# EAGLE design NYSERDA_LCS_PROJECT_V1 (EAGLE 9.0.1)
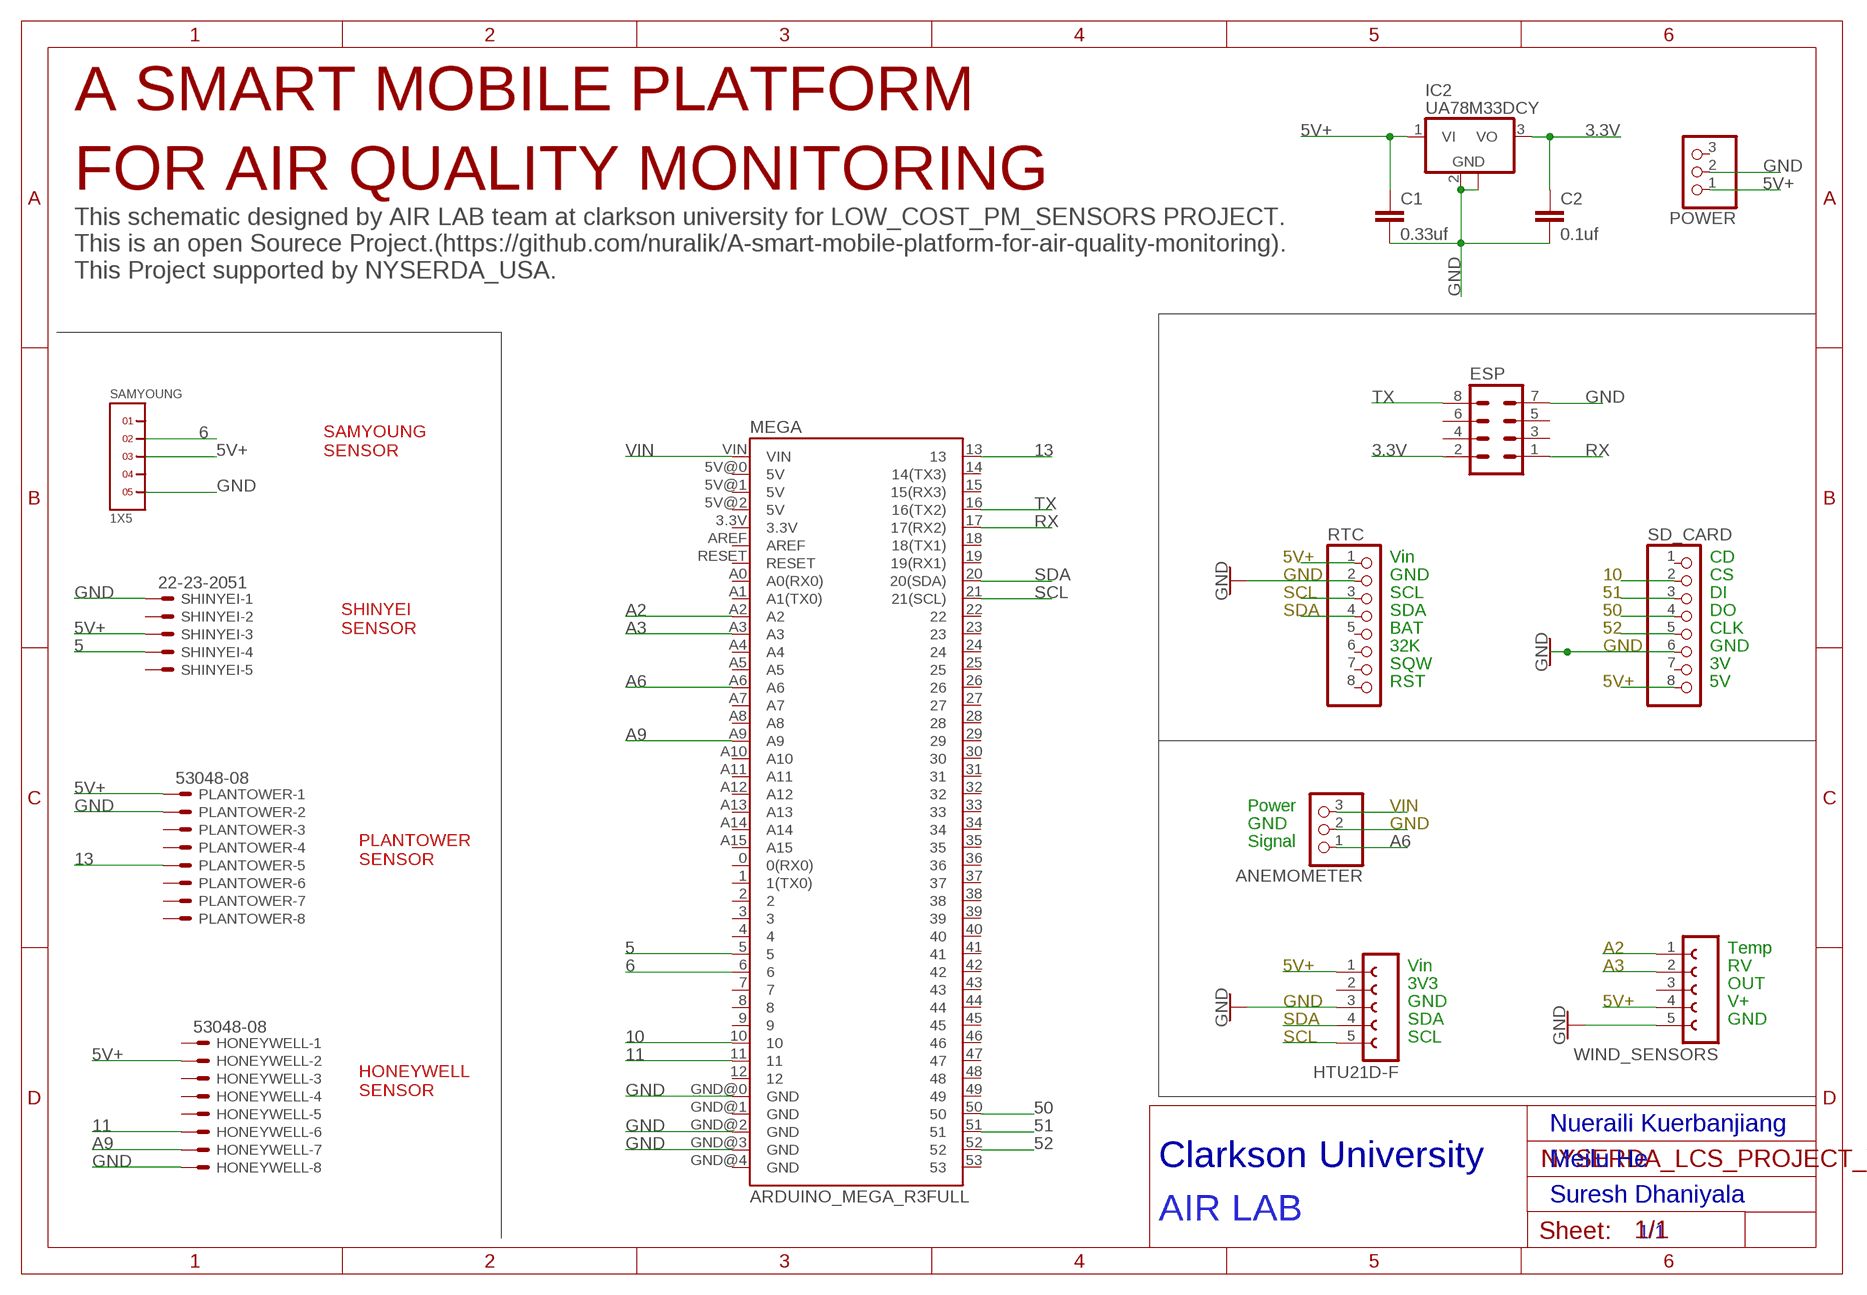
[diagram p0: schematic, sheet 1]

## Parts
ANEMOMETER  PINHD-1X3  [1X03]
C1  0.33uf  C2.5/2  [C2.5-2]
C2  0.1uf  C2.5/2  [C2.5-2]
ESP  MA04-2  [MA04-2]
HONEYWELL  53048-08  [53048-08]
HTU21D-F  FE05-1  [FE05-1]
IC2  UA78M33DCY  [SOT223]
MEGA  ARDUINO_MEGA_R3FULL  [ARDUINO_MEGA]
PLANTOWER  53048-08  [53048-08]
POWER  PINHD-1X3  [1X03]
RTC  PINHD-1X8BIG  [1X08-BIG]
SAMYOUNG  1X5  [1X5]
SD_CARD  PINHD-1X8BIG  [1X08-BIG]
SHINYEI  22-23-2051  [22-23-2051]
WIND_SENSORS  FE05-1  [FE05-1]

## Nets
3.3V: C2.1 ESP.2 IC2.3(VO)
5: MEGA.5 SHINYEI.4
5V+: C1.1 HONEYWELL.2 HTU21D-F.1 IC2.1(VI) PLANTOWER.1 POWER.1 RTC.1 SAMYOUNG.3 SD_CARD.8 SHINYEI.3 WIND_SENSORS.4
6: MEGA.6 SAMYOUNG.2
10: MEGA.10 SD_CARD.2
11: HONEYWELL.6 MEGA.11
13: MEGA.13 PLANTOWER.5
50: MEGA.50 SD_CARD.4
51: MEGA.51 SD_CARD.3
52: MEGA.52 SD_CARD.5
A2: MEGA.A2 WIND_SENSORS.1
A3: MEGA.A3 WIND_SENSORS.2
A6: ANEMOMETER.1 MEGA.A6
A9: HONEYWELL.7 MEGA.A9
GND: ANEMOMETER.2 C1.2 C2.2 ESP.7 HONEYWELL.8 HTU21D-F.3 IC2.2(GND) IC2.4(GND) MEGA.GND@0(GND) MEGA.GND@2(GND) MEGA.GND@3(GND) PLANTOWER.2 POWER.2 RTC.2 SAMYOUNG.5 SD_CARD.6 SHINYEI.1 WIND_SENSORS.5
RX: ESP.1 MEGA.17(17(RX2))
SCL: HTU21D-F.5 MEGA.21(21(SCL)) RTC.3
SDA: HTU21D-F.4 MEGA.20(20(SDA)) RTC.4
TX: ESP.8 MEGA.16(16(TX2))
VIN: ANEMOMETER.3 MEGA.VIN
Unconnected: ESP.3 ESP.4 ESP.5 ESP.6 HONEYWELL.1 HONEYWELL.3 HONEYWELL.4 HONEYWELL.5 HTU21D-F.2 MEGA.0(0(RX0)) MEGA.1(1(TX0)) MEGA.2 MEGA.3 MEGA.3.3V MEGA.4 MEGA.5V@0(5V) MEGA.5V@1(5V) MEGA.5V@2(5V) MEGA.7 MEGA.8 MEGA.9 MEGA.12 MEGA.14(14(TX3)) MEGA.15(15(RX3)) MEGA.18(18(TX1)) MEGA.19(19(RX1)) MEGA.22 MEGA.23 MEGA.24 MEGA.25 MEGA.26 MEGA.27 MEGA.28 MEGA.29 MEGA.30 MEGA.31 MEGA.32 MEGA.33 MEGA.34 MEGA.35 MEGA.36 MEGA.37 MEGA.38 MEGA.39 MEGA.40 MEGA.41 MEGA.42 MEGA.43 MEGA.44 MEGA.45 MEGA.46 MEGA.47 MEGA.48 MEGA.49 MEGA.53 MEGA.A0(A0(RX0)) MEGA.A1(A1(TX0)) MEGA.A4 MEGA.A5 MEGA.A7 MEGA.A8 MEGA.A10 MEGA.A11 MEGA.A12 MEGA.A13 MEGA.A14 MEGA.A15 MEGA.AREF MEGA.GND@1(GND) MEGA.GND@4(GND) MEGA.RESET PLANTOWER.3 PLANTOWER.4 PLANTOWER.6 PLANTOWER.7 PLANTOWER.8 POWER.3 RTC.5 RTC.6 RTC.7 RTC.8 SAMYOUNG.1 SAMYOUNG.4 SD_CARD.1 SD_CARD.7 SHINYEI.2 SHINYEI.5 WIND_SENSORS.3

## Notes on the sheet
- A SMART MOBILE PLATFORM 
  FOR AIR QUALITY MONITORING
- This schematic designed by AIR LAB team at clarkson university for LOW_COST_PM_SENSORS PROJECT.
  This is an open Sourece Project.(https://github.com/nuralik/A-smart-mobile-platform-for-air-quality-monitoring).
  This Project supported by NYSERDA_USA.
- SAMYOUNG
  SENSOR
- Vin | CD
- GND | CS
- SCL | DI
- SDA | DO
- SHINYEI 
  SENSOR
- BAT | CLK
- 32K | GND
- SQW | 3V
- RST | 5V
- Power
- GND
- Signal
- PLANTOWER
  SENSOR
- Temp
- Vin | RV
- 3V3 | OUT
- GND | V+
- SDA | GND
- SCL
- HONEYWELL
  SENSOR
- Nueraili Kuerbanjiang
- Clarkson | University | Meilu He
- Suresh Dhaniyala
- AIR LAB
- 1/1

## Library data of the parts
ANEMOMETER POWER = adafruit:PINHD-1X3: PIN HEADER
C1 C2 = capacitor-wima:C: CAPACITOR naming: grid - package width
ESP = con-lstb:MA04-2: PIN HEADER; OC_FARNELL: unknown; OC_NEWARK: unknown
HONEYWELL PLANTOWER = con-molex:53?-08: CONNECTOR wire to board 1.25 mm (.049 inch) pitch header; MF: WALDOM/MOLEX; MPN: 53048-0810; OC_FARNELL: 9733094; OC_NEWARK: 38C9913
HTU21D-F WIND_SENSORS = con-lsta:FE05-1: FEMALE HEADER; OC_FARNELL: unknown; OC_NEWARK: unknown
IC2 = linear:UA78M*: POSITIVE-VOLTAGE REGULATORS Source: http://focus.ti.com/lit/ds/symlink/ua78m33.pdf
MEGA = SparkFun-Boards:ARDUINO_MEGA_R3: Arduino Mega R3 ATmega2560 R3 compatible footprint. SparkFun Products: Arduino Mega 2560 R3 <https://www.sparkfun.com/products/11061>
RTC SD_CARD = adafruit:PINHD-1X8: PIN HEADER
SAMYOUNG = headers(2mm)(samtec):1X5
SHINYEI = con-molex:22-23-2051: .100" (2.54mm) Center Header - 5 Pin; MF: MOLEX; MPN: 22-23-2051; OC_FARNELL: 1462952; OC_NEWARK: 38C9178

## Board
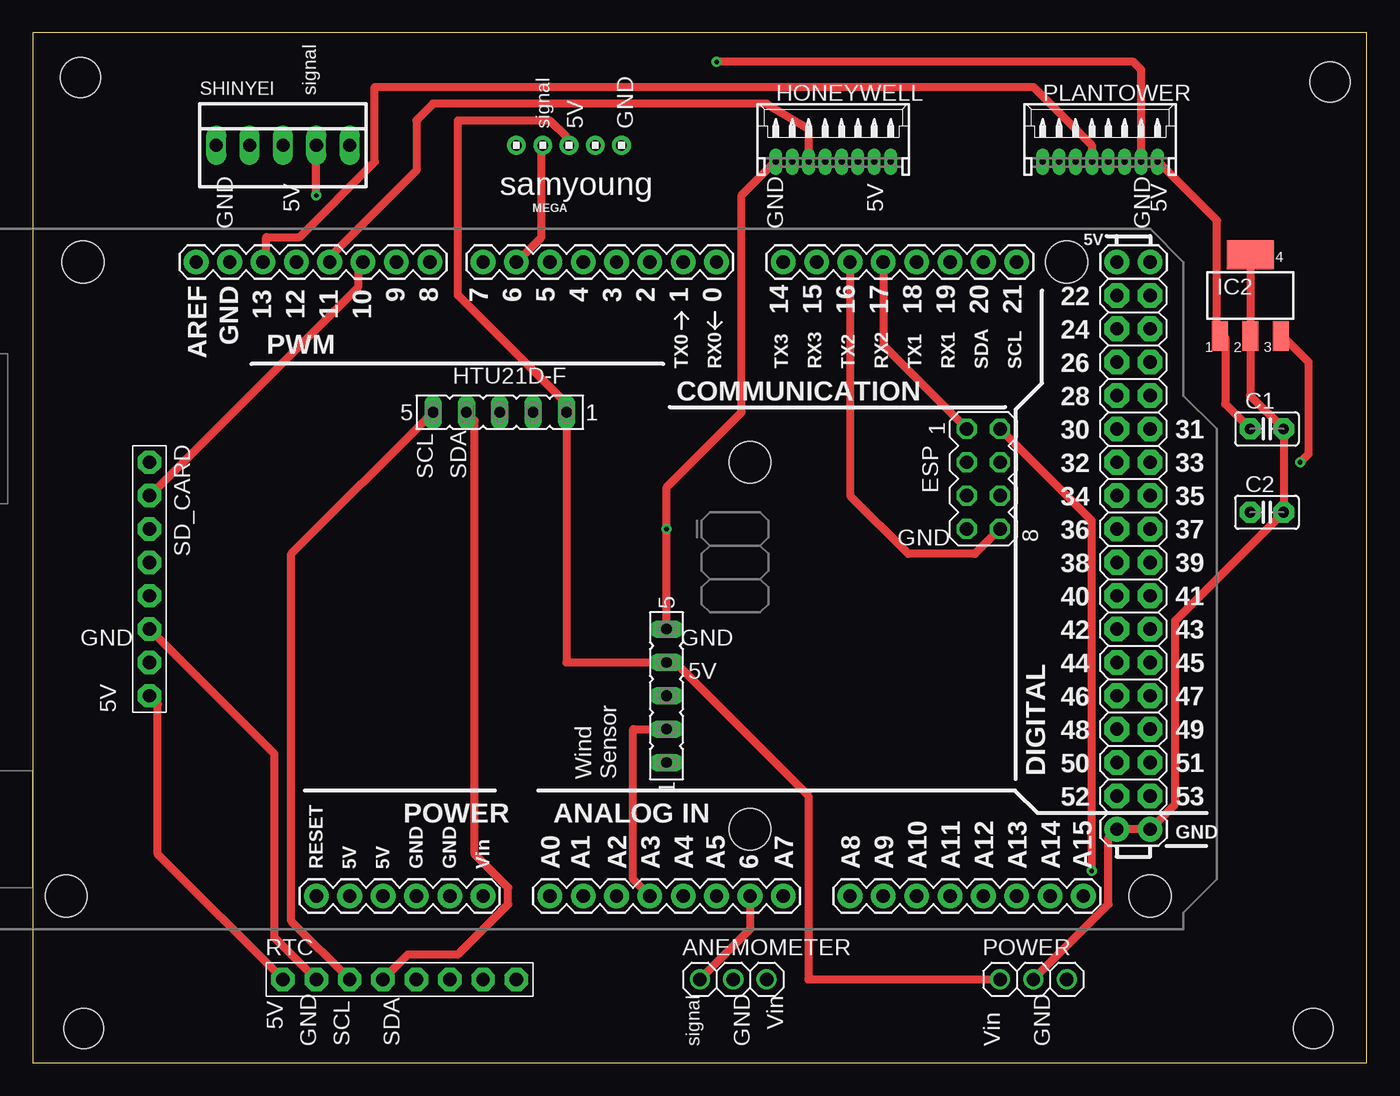
[diagram p1: board, top side]
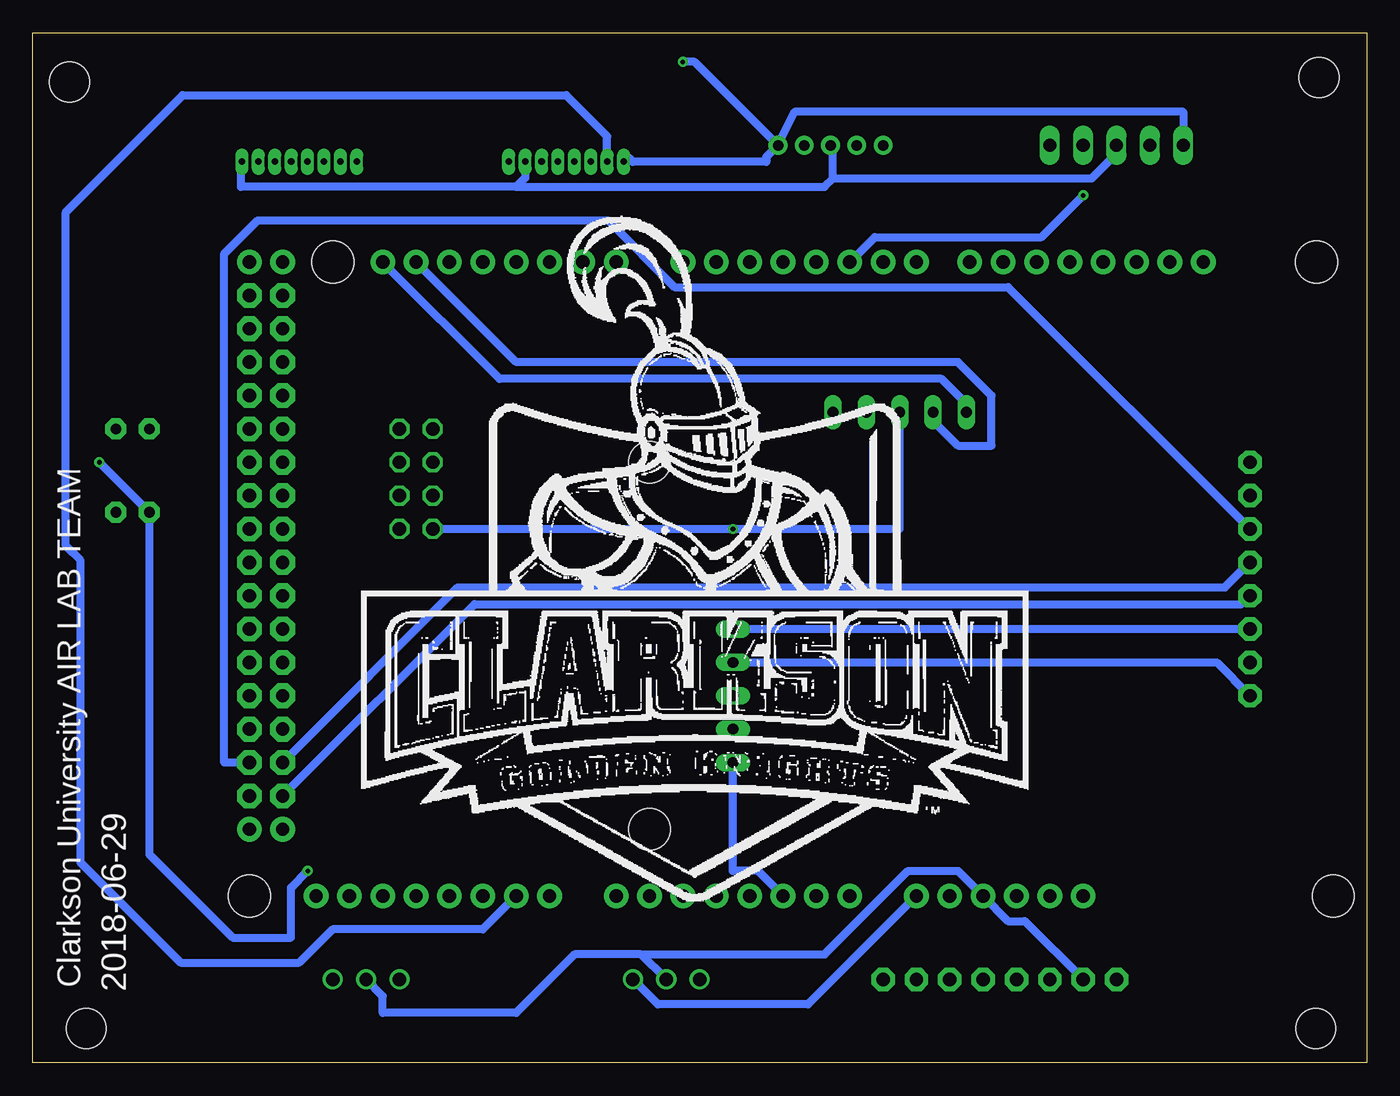
[diagram p2: board, bottom side, seen from below]

Size 101.58 x 78.41 mm. Coordinates in mm from the lower left corner, seen from the top.
Outline: 0,0 101.58,0 101.58,78.41 0,78.41 0,0
Copper layers (1*16): Top 0.035mm / dielectric 1.5mm / Bottom 0.035mm
Design rules "default *": minimum track width 24mil, minimum drill 0.35mm, track to track 16mil, track to pad 16mil, pad to pad 6mil, via to via 16mil, smd to smd 6mil, copper to edge 40mil, drill to drill 6mil, minimum pad ring 10mil, minimum via ring 8mil, stop-mask expansion 4mil, vias tented up to drill 0mil, thermal gap 10mil
Holes 3.05 mm at 3.63,75 3.88,2.62 97.51,2.62 98.78,74.67

### Footprints (pad centres in the part's own frame; a part is rotated, then mirrored left to right if it is on the bottom)
1X03 = drill 1.016: 1 -2.54,0; 2 0,0; 3 2.54,0
C2.5-2 = drill 0.813 pad 1.6 octagon: 1 -1.27,0; 2 1.27,0
MA04-2 = drill 1.016 octagon: 1 -3.81,-1.27; 2 -3.81,1.27; 3 -1.27,-1.27; 4 -1.27,1.27; 5 1.27,-1.27; 6 1.27,1.27; 7 3.81,-1.27; 8 3.81,1.27
53048-08 = drill 0.5 pad 0.698 long: 1 4.375,-1.25; 2 3.125,-1.25; 3 1.875,-1.25; 4 0.625,-1.25; 5 -0.625,-1.25; 6 -1.875,-1.25; 7 -3.125,-1.25; 8 -4.375,-1.25
FE05-1 = drill 0.813 long: 1 -5.08,0; 2 -2.54,0; 3 0,0; 4 2.54,0; 5 5.08,0
SOT223 = smd 1.219 x 2.235: 1 -2.311,-3.099; 2 0,-3.099; 3 2.311,-3.099 | smd 3.6 x 2.2: 4 0,3.099
ARDUINO_MEGA = drill 1.016 pad 1.88: 0 13.97,24.13; 1 11.43,24.13; 2 8.89,24.13; 3 6.35,24.13; 3.3V -13.97,-24.13; 4 3.81,24.13; 5 1.27,24.13; 5V@0 -11.43,-24.13; 5V@1 44.45,24.13; 5V@2 46.99,24.13; 6 -1.27,24.13; 7 -3.81,24.13; 8 -7.874,24.13; 9 -10.414,24.13; 10 -12.954,24.13; 11 -15.494,24.13; 12 -18.034,24.13; 13 -20.574,24.13; 14 19.05,24.13; 15 21.59,24.13; 16 24.13,24.13; 17 26.67,24.13; 18 29.21,24.13; 19 31.75,24.13; 20 34.29,24.13; 21 36.83,24.13; A0 1.27,-24.13; A1 3.81,-24.13; A2 6.35,-24.13; A3 8.89,-24.13; A4 11.43,-24.13; A5 13.97,-24.13; A6 16.51,-24.13; A7 19.05,-24.13; A8 24.13,-24.13; A9 26.67,-24.13; A10 29.21,-24.13; A11 31.75,-24.13; A12 34.29,-24.13; A13 36.83,-24.13; A14 39.37,-24.13; A15 41.91,-24.13; AREF -25.654,24.13; GND@0 -8.89,-24.13; GND@1 -6.35,-24.13; GND@2 44.45,-19.05; GND@3 46.99,-19.05; GND@4 -23.114,24.13; RESET -16.51,-24.13; VIN -3.81,-24.13 | drill 1.016 pad 1.88 octagon: 22 44.45,21.59; 23 46.99,21.59; 24 44.45,19.05; 25 46.99,19.05; 26 44.45,16.51; 27 46.99,16.51; 28 44.45,13.97; 29 46.99,13.97; 30 44.45,11.43; 31 46.99,11.43; 32 44.45,8.89; 33 46.99,8.89; 34 44.45,6.35; 35 46.99,6.35; 36 44.45,3.81; 37 46.99,3.81; 38 44.45,1.27; 39 46.99,1.27; 40 44.45,-1.27; 41 46.99,-1.27; 42 44.45,-3.81; 43 46.99,-3.81; 44 44.45,-6.35; 45 46.99,-6.35; 46 44.45,-8.89; 47 46.99,-8.89; 48 44.45,-11.43; 49 46.99,-11.43; 50 44.45,-13.97; 51 46.99,-13.97; 52 44.45,-16.51; 53 46.99,-16.51 | hole 3.2: -34.29,24.13; -35.56,-24.13; 16.51,8.89; 16.51,-19.05; 40.64,24.13; 46.99,-24.13
1X08-BIG = drill 1.016 pad 1.778 octagon: 1 -8.89,0; 2 -6.35,0; 3 -3.81,0; 4 -1.27,0; 5 1.27,0; 6 3.81,0; 7 6.35,0; 8 8.89,0
1X5 = drill 0.8 pad 1.422: 1 0,0; 2 2,0; 3 4,0; 4 6,0; 5 8,0
22-23-2051 = drill 1 long: 1 -5.08,0; 2 -2.54,0; 3 0,0; 4 2.54,0; 5 5.08,0

### Placement (x,y rotation side)
ANEMOMETER  53.34,6.35 0 top
C1  93.98,48.26 0 top
C2  93.98,41.91 0 top
ESP  72.39,44.45 270 top
HONEYWELL  60.96,69.85 0 top
HTU21D-F  35.56,49.53 180 top
IC2  92.71,58.42 0 top
MEGA  38.1,36.83 0 top
PLANTOWER  81.28,69.85 0 top
POWER  76.2,6.35 0 top
RTC  27.94,6.35 0 top
SAMYOUNG  36.83,69.85 0 top
SD_CARD  8.89,36.83 270 top
SHINYEI  19.05,69.85 0 top
WIND_SENSORS  48.26,27.94 90 top

### Tracks (layer width: path | path; a pad name or v marks a point on that pad's centre or on a via)
3.3V  (via drill 0.35)
  Top 0.61: v96.52,45.72 97.16,46.35 97.16,53.34 95.25,55.24 IC2.3 | ESP.2 80.65,41.27 v80.65,14.61
  Bottom 0.61: v96.52,45.72 C2.1 92.71,15.87 86.36,9.53 81.91,9.53 81.91,13.33 v80.65,14.61
5  (via drill 0.35)
  Top 0.61: v21.59,66.04 SHINYEI.4
  Bottom 0.61: v21.59,66.04 24.76,62.86 37.47,62.86 MEGA.5
5V+
  Top 0.61: SD_CARD.8 9.53,27.3 9.53,15.87 RTC.1 | PLANTOWER.1 85.72,68.58 90.17,64.13 90.17,55.88 IC2.1 90.81,55.24 90.81,50.16 C1.1 | POWER.1 59.06,6.35 59.06,20.32 48.9,30.48 WIND_SENSORS.4 40.64,30.48 HTU21D-F.1 40.64,50.16 32.38,58.42 32.38,71.75 39.37,71.75 40.64,70.48 40.64,69.85 SAMYOUNG.3
  Bottom 0.61: 40.64,67.31 40.64,69.85 SAMYOUNG.3 | 40.64,67.31 20.96,67.31 19.05,69.21 SHINYEI.3 | 64.77,66.67 41.28,66.67 40.64,67.31 | 64.77,66.67 85.72,66.67 85.72,68.58 PLANTOWER.1 | SD_CARD.8 11.43,30.48 WIND_SENSORS.4 | HONEYWELL.2 64.09,67.36 64.77,66.67
6
  Top 0.61: MEGA.6 38.73,62.86 38.73,69.85 SAMYOUNG.2
10
  Top 0.61: SD_CARD.2 24.76,59.05 24.76,60.96 MEGA.10
11
  Top 0.61: HONEYWELL.6 59.06,69.21 59.06,71.12 55.88,73.02 30.48,73.02 29.21,71.75 29.21,67.94 22.86,61.59 22.86,60.96 MEGA.11
13
  Top 0.61: PLANTOWER.5 80.65,69.21 80.65,69.85 76.2,74.3 26.03,74.3 26.03,68.58 20.32,62.86 17.78,62.86 17.78,60.96 MEGA.13
50
  Bottom 0.61: SD_CARD.4 10.79,36.19 69.22,36.19 MEGA.50
51
  Bottom 0.61: SD_CARD.3 27.31,59.05 52.71,59.05 57.78,64.13 84.46,64.13 87,61.59 87,22.86 MEGA.51
52
  Bottom 0.61: SD_CARD.5 9.53,34.92 67.94,34.92 MEGA.52
A2
  Bottom 0.61: WIND_SENSORS.1 48.26,14.61 46.35,14.61 MEGA.A2
A3
  Top 0.61: WIND_SENSORS.2 45.72,25.4 45.72,13.97 MEGA.A3
A6
  Top 0.61: ANEMOMETER.1 54.61,10.16 MEGA.A6
A9
  Bottom 0.61: MEGA.A9 67.31,10.16 78.74,10.16 81.28,7.62 90.33,7.62 97.95,15.24 97.95,38.26 99.06,39.37 99.06,64.77 90.17,73.66 60.96,73.66 57.84,70.53 HONEYWELL.7
GND  (via drill 0.35)
  Top 0.61: IC2.4 IC2.2 92.71,50.8 C1.2 C2.2 87,33.66 87,19.68 MEGA.GND@3 MEGA.GND@2 81.91,17.14 81.91,12.07 POWER.2 | SD_CARD.6 18.41,23.5 18.41,9.53 RTC.2 | WIND_SENSORS.5 v48.26,40.64 48.26,43.81 53.97,49.53 53.97,66.04 56.51,68.58 HONEYWELL.8 | PLANTOWER.2 84.41,75.61 83.82,76.2 v52.07,76.2
  Bottom 0.61: HTU21D-F.3 35.56,40.64 v48.26,40.64 ESP.7 | HONEYWELL.8 56.51,69.21 55.88,68.58 45.72,68.58 45.72,68.96 SAMYOUNG.5 | SHINYEI.1 13.97,72.39 43.56,72.39 SAMYOUNG.5 | SD_CARD.6 WIND_SENSORS.5 | RTC.2 26.03,10.79 27.31,10.79 MEGA.GND@0 31.12,14.61 34.93,14.61 41.28,8.25 55.25,8.25 | ANEMOMETER.2 55.25,8.25 | v52.07,76.2 51.18,76.2 SAMYOUNG.5 | 55.25,8.25 60.32,8.25 64.77,3.81 74.93,3.81 74.93,5.08 POWER.2
RX
  Top 0.61: ESP.1 64.77,54.61 MEGA.17
SCL
  Top 0.61: HTU21D-F.5 19.69,38.73 19.69,10.79 RTC.3
  Bottom 0.61: MEGA.21 66.04,52.07 32.38,52.07 30.48,50.16 HTU21D-F.5
SDA
  Top 0.61: HTU21D-F.4 33.66,48.89 33.66,15.87 36.19,13.33 36.19,12.07 32.38,8.25 28.57,8.25 RTC.4
  Bottom 0.61: MEGA.20 64.77,53.34 31.12,53.34 28.57,50.8 28.57,46.99 31.12,46.99 33.02,48.89 HTU21D-F.4
TX
  Top 0.61: ESP.8 71.75,38.73 66.68,38.73 62.23,43.18 MEGA.16
VIN
  Bottom 0.61: ANEMOMETER.3 53.97,4.44 42.54,4.44 MEGA.VIN

### Text on the board
tOrigins: C:/Users/kuerban/Desktop/Clarkson_Golden_Knights_1.bmp
tNames: signal | signal | 5V | GND | samyoung | 5V | 5V | 5V | GND | GND | GND | SCL | SDA | GND | GND | GND | 5V | 5V | Wind / Sensor | 5V | Vin | GND | SCL | SDA | signal | GND | Vin | GND
bNames: 2018-06-29 | Clarkson University AIR LAB TEAM